# EAGLE design untitled (EAGLE 4.16)
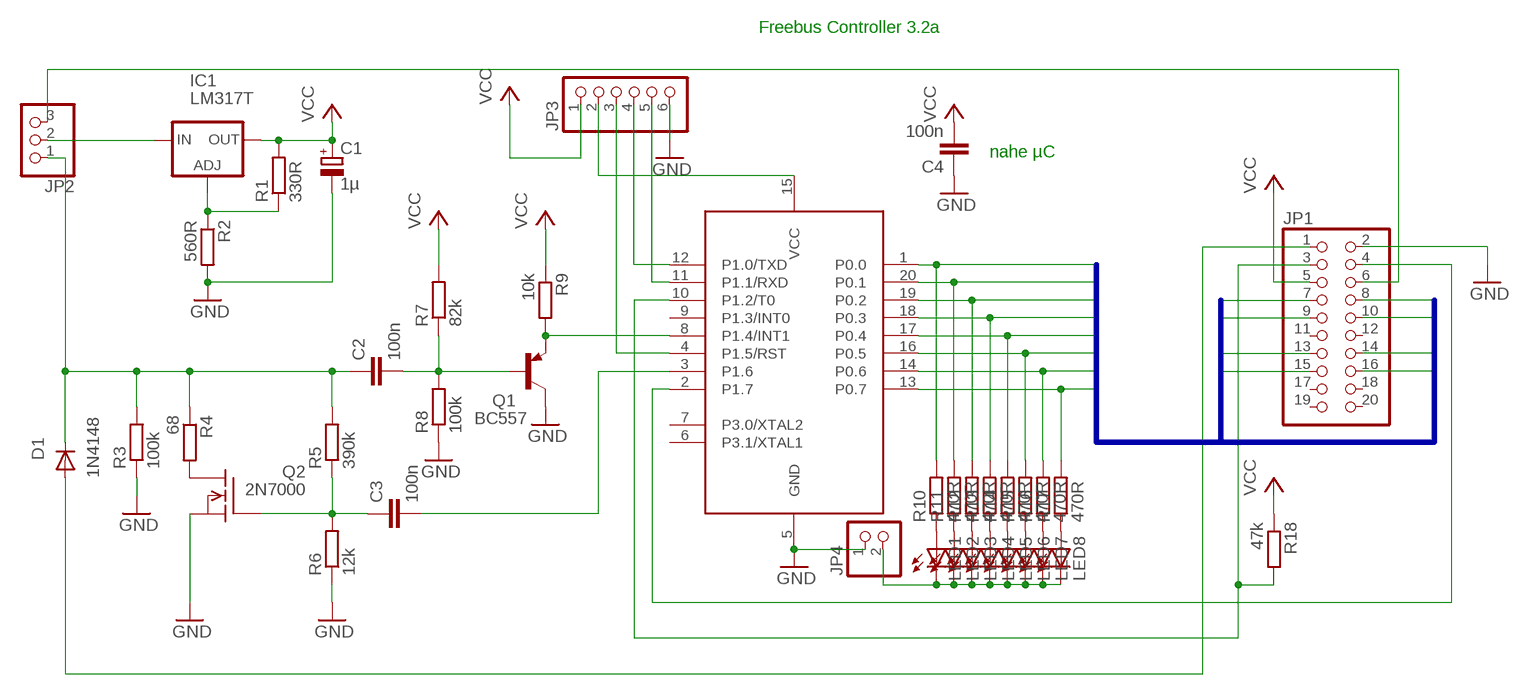
[diagram p0: schematic, sheet 1]

## Parts
C1  1µ  CPOL-EUE2.5-5  [E2,5-5]
C2  100n  C-EU050-024X044  [C050-024X044]
C3  100n  C-EU050-024X044  [C050-024X044]
C4  100n  C-EU050-024X044  [C050-024X044]
D1  1N4148  [DO35-10]
IC1  LM317T  LM317L  [317L]
JP1  PINHD-2X10  [2X10]
JP2  PINHD-1X3  [1X03]
JP3  PINHD-1X6  [1X06]
JP4  PINHD-1X2  [1X02]
LED1  LED3MM  [LED3MM]
LED2  LED3MM  [LED3MM]
LED3  LED3MM  [LED3MM]
LED4  LED3MM  [LED3MM]
LED5  LED3MM  [LED3MM]
LED6  LED3MM  [LED3MM]
LED7  LED3MM  [LED3MM]
LED8  LED3MM  [LED3MM]
Q1  BC557  [TO92]
Q2  2N7000  VN2222KM  [TO237]
R1  330R  R-EU_0207/10  [0207/10]
R2  560R  R-EU_0207/10  [0207/10]
R3  100k  R-EU_0207/10  [0207/10]
R4  68  R-EU_0207/10  [0207/10]
R5  390k  R-EU_0207/10  [0207/10]
R6  12k  R-EU_0207/10  [0207/10]
R7  82k  R-EU_0207/10  [0207/10]
R8  100k  R-EU_0207/10  [0207/10]
R9  10k  R-EU_0207/10  [0207/10]
R10  470R  R-EU_0207/10  [0207/10]
R11  470R  R-EU_0207/10  [0207/10]
R12  470R  R-EU_0207/10  [0207/10]
R13  470R  R-EU_0207/10  [0207/10]
R14  470R  R-EU_0207/10  [0207/10]
R15  470R  R-EU_0207/10  [0207/10]
R16  470R  R-EU_0207/10  [0207/10]
R17  470R  R-EU_0207/10  [0207/10]
R18  47k  R-EU_0207/10  [0207/10]
U1  89LPC922  [DIL20]

## Nets
GND: C1.- C4.1 JP1.2 JP3.6 JP4.1 Q1.3(C) Q2.3(S) R2.2 R3.1 R6.1 R8.1 U1.5(GND)
N$1: Q1.1(E) R9.2 U1.8(P1.4/INT1)
N$2: C2.2 Q1.2(B) R7.1 R8.2
N$5: C3.2 U1.3(P1.6)
N$6: Q2.1(D) R4.2
N$7: IC1.1(ADJ) R1.1 R2.1
N$9: C2.1 D1.C JP2.1 R3.2 R4.1 R5.2
N$16: D1.A JP1.1
N$17: JP1.4 U1.2(P1.7)
N$18: IC1.3(IN) JP2.2
N$19: JP1.6 JP2.3
N$20: LED1.A R10.1
N$21: LED2.A R11.1
N$22: LED3.A R12.1
N$23: LED4.A R13.1
N$24: LED5.A R14.1
N$25: LED6.A R15.1
N$26: LED7.A R16.1
N$27: LED8.A R17.1
N$28: JP4.2 LED1.K(C) LED2.K(C) LED3.K(C) LED4.K(C) LED5.K(C) LED6.K(C) LED7.K(C) LED8.K(C)
N$29: JP3.4 U1.12(P1.0/TXD)
N$30: JP3.5 U1.11(P1.1/RXD)
N$31: JP3.3 U1.4(P1.5/RST)
N$32: JP3.2 U1.15(VCC)
N$33: JP1.3 R18.2 U1.10(P1.2/T0)
N$34: C3.1 Q2.2(G) R5.1 R6.2
P0.0: JP1.7 R10.2 U1.1(P0.0)
P0.1: JP1.8 R11.2 U1.20(P0.1)
P0.2: JP1.9 R12.2 U1.19(P0.2)
P0.3: JP1.10 R13.2 U1.18(P0.3)
P0.4: JP1.13 R14.2 U1.17(P0.4)
P0.5: JP1.14 R15.2 U1.16(P0.5)
P0.6: JP1.15 R16.2 U1.14(P0.6)
P0.7: JP1.16 R17.2 U1.13(P0.7)
VCC: C1.+ C4.2 IC1.2(OUT) JP1.5 JP3.1 R1.2 R7.2 R9.1 R18.1
Unconnected: JP1.11 JP1.12 JP1.17 JP1.18 JP1.19 JP1.20 U1.6(P3.1/XTAL1) U1.7(P3.0/XTAL2) U1.9(P1.3/INT0)

## Buses
P0.[0..7]

## Notes on the sheet
- Freebus Controller 3.2a
- nahe µC

## Library data of the parts
C1 = rcl:CPOL-EU: POLARIZED CAPACITOR, European symbol
C2-C4 = rcl:C-EU: CAPACITOR, European symbol
D1 = diode:1N4148: DIODE high speed (Philips)
IC1 = v-reg:LM317L: VOLTAGE REGULATOR
JP1 = pinhead:PINHD-2X10: PIN HEADER
JP2 = pinhead:PINHD-1X3: PIN HEADER
JP3 = pinhead:PINHD-1X6: PIN HEADER
JP4 = pinhead:PINHD-1X2: PIN HEADER
LED1-LED8 = led:LED: LED OSRAM: - CHIPLED LG R971, LG N971, LY N971, LG Q971, LY Q971, LO R971, LY R971 LH N974, LH R974 LS Q976, LO Q976, LY Q976 LO Q996 - Hyper CHIPLED LW Q18S LB Q993, LB Q99A, LB R99A - SideLED LS A670, LO A670, LY A670, LG A670, LP A670 LB A673, LV A673, LT A673, LW A673 LH A674 LY A675 LS A676, LA A676, LO A676, LY A676, LW A676 LS A679, LY A679, LG A679 - Hyper Micro SIDELED® LS Y876, LA Y876, LO Y876, LY Y876 LT Y87S - SmartLED LW L88C, LW L88S LB L89C, LB L89S, LG L890 LS L89K, LO L89K, LY L89K LS L896, LA L896, LO L896, LY L896 - TOPLED LS T670, LO T670, LY T670, LG T670, LP T670 LSG T670, LSP T670, LSY T670, LOP T670, LYG T670 LG T671, LOG T671, LSG T671 LB T673, LV T673, LT T673, LW T673 LH T674 LS T676, LA T676, LO T676, LY T676, LB T676, LH T676, LSB T676, LW T676 LB T67C, LV T67C, LT T67C, LS T67K, LO T67K, LY T67K, LW E67C LS E67B, LA E67B, LO E67B, LY E67B, LB E67C, LV E67C, LT E67C LW T67C LS T679, LY T679, LG T679 LS T770, LO T770, LY T770, LG T770, LP T770 LB T773, LV T773, LT T773, LW T773 LH T774 LS E675, LA E675, LY E675, LS T675 LS T776, LA T776, LO T776, LY T776, LB T776 LHGB T686 LT T68C, LB T68C - Hyper Mini TOPLED® LB M676 - Mini TOPLED Santana® LG M470 LS M47K, LO M47K, LY M47K Source: http://www.osram.convergy.de - LUMILED® LXK2-PW12-R00, LXK2-PW12-S00, LXK2-PW14-U00, LXK2-PW14-V00 LXK2-PM12-R00, LXK2-PM12-S00, LXK2-PM14-U00 LXK2-PE12-Q00, LXK2-PE12-R00, LXK2-PE12-S00, LXK2-PE14-T00, LXK2-PE14-U00 LXK2-PB12-K00, LXK2-PB12-L00, LXK2-PB12-M00, LXK2-PB14-N00, LXK2-PB14-P00, LXK2-PB14-Q00 LXK2-PR12-L00, LXK2-PR12-M00, LXK2-PR14-Q00, LXK2-PR14-R00 LXK2-PD12-Q00, LXK2-PD12-R00, LXK2-PD12-S00 LXK2-PH12-R00, LXK2-PH12-S00 LXK2-PL12-P00, LXK2-PL12-Q00, LXK2-PL12-R00 Source: www.luxeon.com
Q1 = transistor-pnp:BC557: PNP Transistor
Q2 = transistor-fet:VN2222KM: N-Channel Enhancement MOSFET (VMOS); 60V; 0,5A; 7,5Ohm
R1-R18 = rcl:R-EU_: RESISTOR, European symbol
U1 = micro-philips:89LPC922

## Board
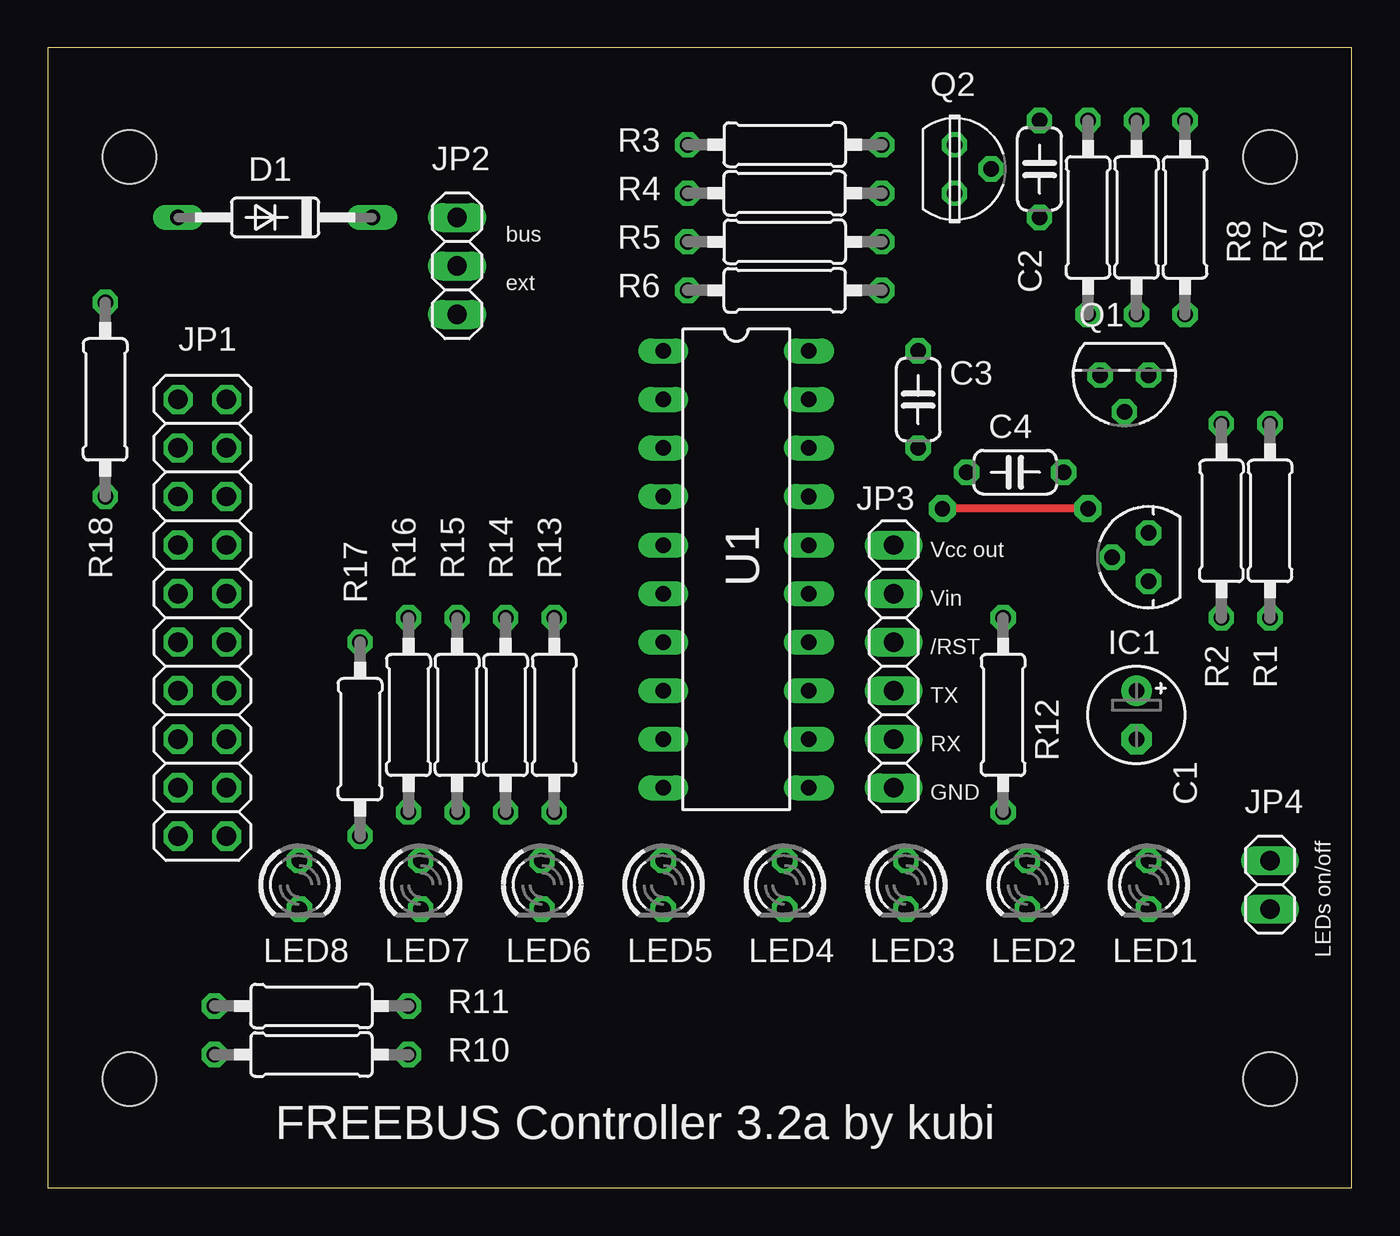
[diagram p1: board, top side]
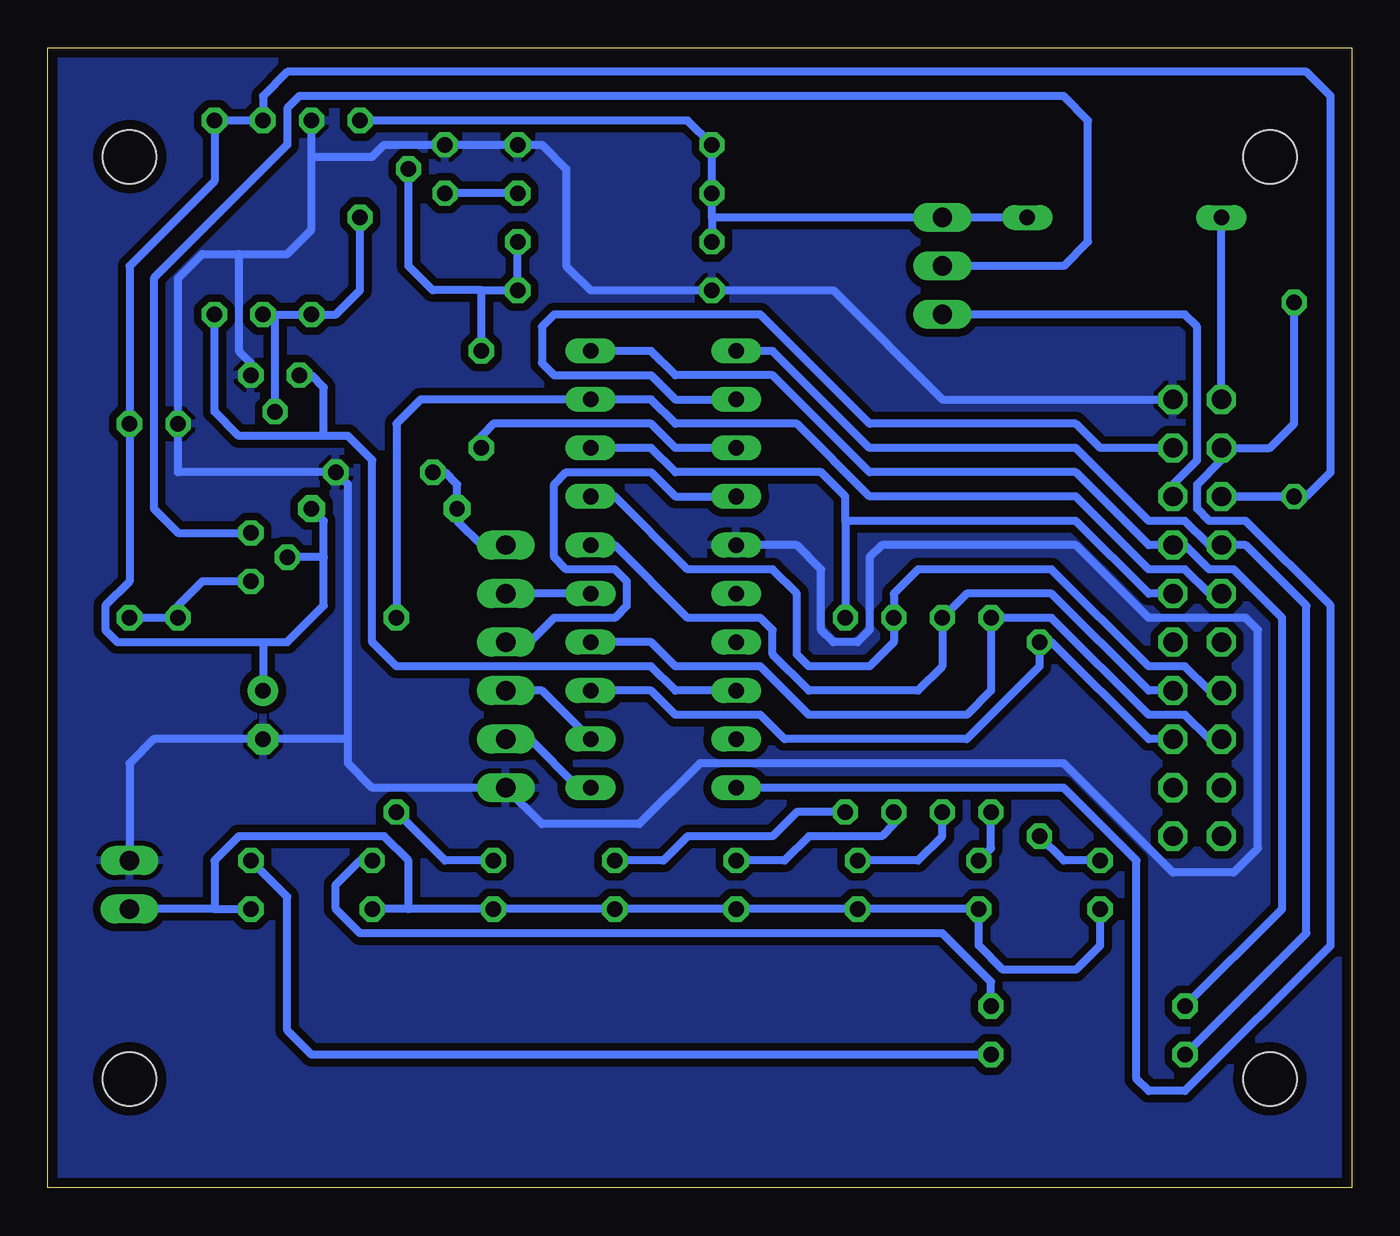
[diagram p2: board, bottom side, seen from below]

Size 68.25 x 59.68 mm. Coordinates in mm from the lower left corner, seen from the top.
Outline: 0,0 68.25,0 68.25,59.68 0,59.68 0,0
Copper layers (1*16): Top 0.035mm / dielectric 1.5mm / Bottom 0.035mm
Design rules "default": minimum track width 10mil, minimum drill 24mil, track to track 16mil, track to pad 12mil, pad to pad 16mil, via to via 16mil, smd to smd 8mil, copper to edge 20mil, drill to drill 8mil, minimum pad ring 10mil, minimum via ring 8mil, stop-mask expansion 4mil, vias tented up to drill 0mil, thermal gap 10mil
Holes 2.8 mm at 4.28,53.97 63.97,53.97 63.97,5.71 4.28,5.71

### Footprints (pad centres in the part's own frame; a part is rotated, then mirrored left to right if it is on the bottom)
E2,5-5 = drill 0.813 pad 1.6 round: + -1.27,0 | drill 0.813 pad 1.6 octagon: - 1.27,0
C050-024X044 = drill 0.813 octagon: 1 -2.54,0; 2 2.54,0
DO35-10 = drill 0.813 long: A 5.08,0; C -5.08,0
317L = drill 0.813 octagon: 1 -1.27,0; 2 0,1.905; 3 1.27,0
2X10 = drill 1.016 octagon: 1 -11.43,-1.27; 2 -11.43,1.27; 3 -8.89,-1.27; 4 -8.89,1.27; 5 -6.35,-1.27; 6 -6.35,1.27; 7 -3.81,-1.27; 8 -3.81,1.27; 9 -1.27,-1.27; 10 -1.27,1.27; 11 1.27,-1.27; 12 1.27,1.27; 13 3.81,-1.27; 14 3.81,1.27; 15 6.35,-1.27; 16 6.35,1.27; 17 8.89,-1.27; 18 8.89,1.27; 19 11.43,-1.27; 20 11.43,1.27
1X03 = drill 1.016 long: 1 -2.54,0; 2 0,0; 3 2.54,0
1X06 = drill 1.016 long: 1 -6.35,0; 2 -3.81,0; 3 -1.27,0; 4 1.27,0; 5 3.81,0; 6 6.35,0
1X02 = drill 1.016 long: 1 -1.27,0; 2 1.27,0
LED3MM = drill 0.813 octagon: A -1.27,0; K 1.27,0
TO92 = drill 0.813 octagon: 1 1.27,0; 2 0,1.905; 3 -1.27,0
TO237 = drill 0.813 octagon: 1 1.27,0; 2 0,1.905; 3 -1.27,0
0207/10 = drill 0.813 octagon: 1 -5.08,0; 2 5.08,0
DIL20 = drill 0.813 long: 1 -11.43,-3.81; 2 -8.89,-3.81; 3 -6.35,-3.81; 4 -3.81,-3.81; 5 -1.27,-3.81; 6 1.27,-3.81; 7 3.81,-3.81; 8 6.35,-3.81; 9 8.89,-3.81; 10 11.43,-3.81; 11 11.43,3.81; 12 8.89,3.81; 13 6.35,3.81; 14 3.81,3.81; 15 1.27,3.81; 16 -1.27,3.81; 17 -3.81,3.81; 18 -6.35,3.81; 19 -8.89,3.81; 20 -11.43,3.81

### Placement (x,y rotation side)
C1  56.98,24.76 270 top
C2  51.91,53.34 270 top
C3  45.55,41.27 270 top
C4  50.63,37.46 180 top
D1  11.9,50.8 180 top
IC1  57.62,33.02 90 top
JP1  8.09,29.84 270 top
JP2  21.42,48.26 270 top
JP3  44.28,27.3 270 top
JP4  63.97,15.87 270 top
LED1  57.62,15.87 270 top
LED2  51.27,15.87 270 top
LED3  44.92,15.87 270 top
LED4  38.57,15.87 270 top
LED5  32.22,15.87 270 top
LED6  25.87,15.87 270 top
LED7  19.52,15.87 270 top
LED8  13.17,15.87 270 top
Q1  56.35,42.54 180 top
Q2  47.46,53.34 270 top
R1  63.97,34.92 90 top
R2  61.43,34.92 90 top
R3  38.57,54.61 180 top
R4  38.57,52.07 0 top
R5  38.57,49.53 180 top
R6  38.57,46.98 0 top
R7  56.98,50.8 90 top
R8  54.45,50.8 270 top
R9  59.52,50.8 270 top
R10  13.81,6.98 180 top
R11  13.81,9.52 180 top
R12  50,24.76 90 top
R13  26.5,24.76 90 top
R14  23.96,24.76 90 top
R15  21.42,24.76 90 top
R16  18.88,24.76 90 top
R17  16.34,23.49 90 top
R18  3.01,41.27 90 top
U1  36.03,32.38 270 top

### Tracks (layer width: path | path; a pad name or v marks a point on that pad's centre or on a via)
GND
  Bottom 0.406: JP1.2 21.42,41.27 27.14,46.98 R6.1 39.84,46.98 41.11,48.26 41.11,53.34 42.38,54.61 R3.1 Q2.3 50.63,54.61 51.27,53.97 54.45,53.97 | U1.5 29.04,33.65 27.77,32.38 27.77,29.2 27.14,28.57 25.87,28.57 25.23,29.2 25.23,33.02 24.6,33.65 14.44,33.65 10.63,29.84 5.55,29.84 4.92,29.2 4.92,17.77 6.18,16.5 9.36,16.5 15.08,22.22 34.12,22.22 37.3,19.04 42.38,19.04 JP3.6 51.27,20.95 52.54,22.22 52.54,23.49 | 52.54,23.49 52.54,36.83 C4.1 61.43,37.46 R2.2 61.43,47.62 60.16,48.89 58.25,48.89 | 54.45,53.97 R8.1 | 58.25,48.89 55.71,48.89 54.45,50.16 54.45,53.97 | Q1.3 57.62,43.18 58.25,43.81 58.25,48.89 | JP4.1 63.97,22.22 62.7,23.49 C1.- 52.54,23.49
  pour Bottom: 0.47,0.63 0.47,59.05 67.78,59.05 67.78,0.63
N$1
  Bottom 0.406: U1.8 35.39,26.03 36.66,27.3 50,27.3 51.27,28.57 51.27,38.1 52.54,39.37 53.81,39.37 | R9.2 59.52,40.64 58.25,39.37 53.81,39.37 | Q1.1 54.45,42.54 53.81,41.91 53.81,39.37
N$2
  Bottom 0.406: 56.35,45.72 R8.2 53.17,45.72 51.91,46.98 C2.2 | 56.35,45.72 R7.1 | Q1.2 56.35,45.72
N$5
  Bottom 0.406: U1.3 35.39,38.73 36.66,40 44.92,40 45.55,39.37 C3.2
N$6
  Bottom 0.406: R4.2 Q2.1
N$7
  Bottom 0.406: R1.1 R2.1 61.43,30.47 60.16,31.74 IC1.1
N$9
  Bottom 0.406: D1.C JP2.1 33.49,50.8 | 33.49,50.8 R5.2 | 33.49,50.8 R4.1 R3.2 34.76,55.88 C2.1
N$16
  Bottom 0.406: JP1.1 D1.A
N$17
  Bottom 0.406: U1.2 35.39,41.27 36.66,42.54 41.74,42.54 42.38,43.18 42.38,45.08 41.74,45.72 30.95,45.72 25.23,40 14.44,40 13.17,38.73 JP1.4
N$18
  Bottom 0.406: JP2.2 15.08,48.26 13.81,49.53 13.81,55.88 15.08,57.15 55.08,57.15 55.71,56.51 55.71,54.61 62.7,47.62 62.7,35.55 61.43,34.29 IC1.3
N$19
  Bottom 0.406: JP2.3 8.73,45.72 8.09,45.08 8.09,38.1 9.36,36.83 JP1.6
N$20
  Bottom 0.406: LED1.A 55.71,15.24 55.71,8.25 54.45,6.98 R10.1
N$21
  Bottom 0.406: R11.1 18.88,10.79 21.42,13.33 51.91,13.33 53.17,14.6 53.17,15.87 51.91,17.14 LED2.A
N$22
  Bottom 0.406: R12.1 47.46,17.14 LED3.A
N$23
  Bottom 0.406: R13.1 29.04,19.68 30.31,18.41 34.76,18.41 36.03,17.14 LED4.A
N$24
  Bottom 0.406: R14.1 23.96,19.04 24.6,18.41 28.41,18.41 29.68,17.14 LED5.A
N$25
  Bottom 0.406: R15.1 21.42,18.41 22.7,17.14 LED6.A
N$26
  Bottom 0.406: R16.1 18.88,17.77 LED7.A
N$27
  Bottom 0.406: LED8.A 15.08,17.14 R17.1
N$28
  Bottom 0.406: LED8.K 13.17,12.7 14.44,11.43 18.25,11.43 19.52,12.7 LED7.K LED6.K LED5.K LED4.K LED3.K 49.37,14.6 | 49.37,14.6 LED2.K | 59.52,14.6 LED1.K | 59.52,14.6 JP4.2 | 49.37,14.6 49.37,17.14 50.63,18.41 58.25,18.41 59.52,17.14 59.52,14.6
N$29
  Bottom 0.406: U1.12 42.38,26.03 JP3.4
N$30
  Bottom 0.406: U1.11 40.48,20.95 43.02,23.49 JP3.5
N$31
  Bottom 0.406: U1.4 35.39,36.19 36.66,37.46 41.11,37.46 41.74,36.83 41.74,33.02 41.11,32.38 38.57,32.38 37.94,31.74 37.94,30.47 38.57,29.84 41.74,29.84 43.02,28.57 JP3.3
N$32
  Bottom 0.406: U1.15 JP3.2
N$33
  Bottom 0.406: U1.10 15.08,20.95 11.27,17.14 11.27,5.71 10.63,5.08 8.73,5.08 1.1,12.7 1.1,30.47 5.55,34.92 7.46,34.92 8.09,35.55 8.09,36.83 6.82,38.1 JP1.3 4.28,38.73 3.01,40 R18.2
N$34
  Bottom 0.406: Q2.2 49.37,48.26 48.09,46.98 45.55,46.98 | 45.55,46.98 R6.2 R5.1 | C3.1 45.55,46.98
P0.0
  Bottom 0.406: U1.1 30.31,43.81 25.23,38.73 14.44,38.73 10.63,34.92 8.73,34.92 7.46,33.65 JP1.7 5.55,33.65 2.38,30.47 2.38,13.33 R10.2
P0.1
  Bottom 0.406: U1.20 36.66,43.81 35.39,42.54 30.31,42.54 25.23,37.46 14.44,37.46 10.63,33.65 JP1.8 8.73,33.65 7.46,32.38 6.18,32.38 3.64,29.84 3.64,14.6 R11.2
P0.2
  Bottom 0.406: JP1.9 7.46,31.11 8.73,32.38 10.63,32.38 14.44,36.19 25.23,36.19 29.04,40 35.39,40 36.66,41.27 U1.19 48.73,41.27 50,40 R12.2
P0.3
  Bottom 0.406: JP1.10 10.63,31.11 14.44,34.92 26.5,34.92 | 26.5,34.92 26.5,36.19 27.77,37.46 35.39,37.46 36.66,38.73 U1.18 | 26.5,34.92 R13.2
P0.4
  Bottom 0.406: U1.17 38.57,36.19 34.76,32.38 30.31,32.38 29.04,31.11 29.04,27.93 28.41,27.3 25.23,27.3 23.96,28.57 R14.2 23.96,31.11 22.7,32.38 15.71,32.38 10.63,27.3 8.73,27.3 7.46,26.03 JP1.13
P0.5
  Bottom 0.406: U1.16 38.57,33.65 34.76,29.84 30.95,29.84 30.31,29.2 30.31,27.93 28.41,26.03 22.7,26.03 21.42,27.3 R15.2 20.15,31.11 15.71,31.11 10.63,26.03 JP1.14
P0.6
  Bottom 0.406: U1.14 36.66,28.57 35.39,27.3 30.95,27.3 28.41,24.76 20.15,24.76 18.88,26.03 R16.2 15.71,29.84 10.63,24.76 8.73,24.76 7.46,23.49 JP1.15
P0.7
  Bottom 0.406: U1.13 36.66,26.03 35.39,24.76 30.95,24.76 29.68,23.49 20.15,23.49 16.34,27.3 R17.2 15.71,28.57 10.63,23.49 JP1.16
VCC  (via drill 0.8 pad 1.42)
  Top 0.406: v54.45,35.55 v46.82,35.55
  Bottom 0.406: R18.1 JP1.5 2.38,36.19 1.1,37.46 1.1,57.15 2.38,58.41 55.71,58.41 56.98,57.15 R7.2 R9.1 59.52,52.7 63.97,48.26 R1.2 63.97,31.74 65.24,30.47 65.24,29.2 64.61,28.57 56.98,28.57 | JP3.1 45.55,33.65 46.82,34.92 v46.82,35.55 46.82,36.83 47.46,37.46 C4.2 | 56.98,28.57 55.71,28.57 53.81,30.47 53.81,33.02 | 53.81,33.02 53.81,34.92 v54.45,35.55 | 56.98,28.57 C1.+ | 53.81,33.02 IC1.2

### Text on the board
tPlace: bus | ext | Vcc out | Vin | /RST | TX | RX | GND | LEDs on/off | FREEBUS Controller 3.2a by kubi